# EasyEDA schematic N2onboardTelemetry.json
TITLE: Sheet_1; REV: 1.0; Date: 2022-01-05; Sheet: 1/1; Company: Your Company
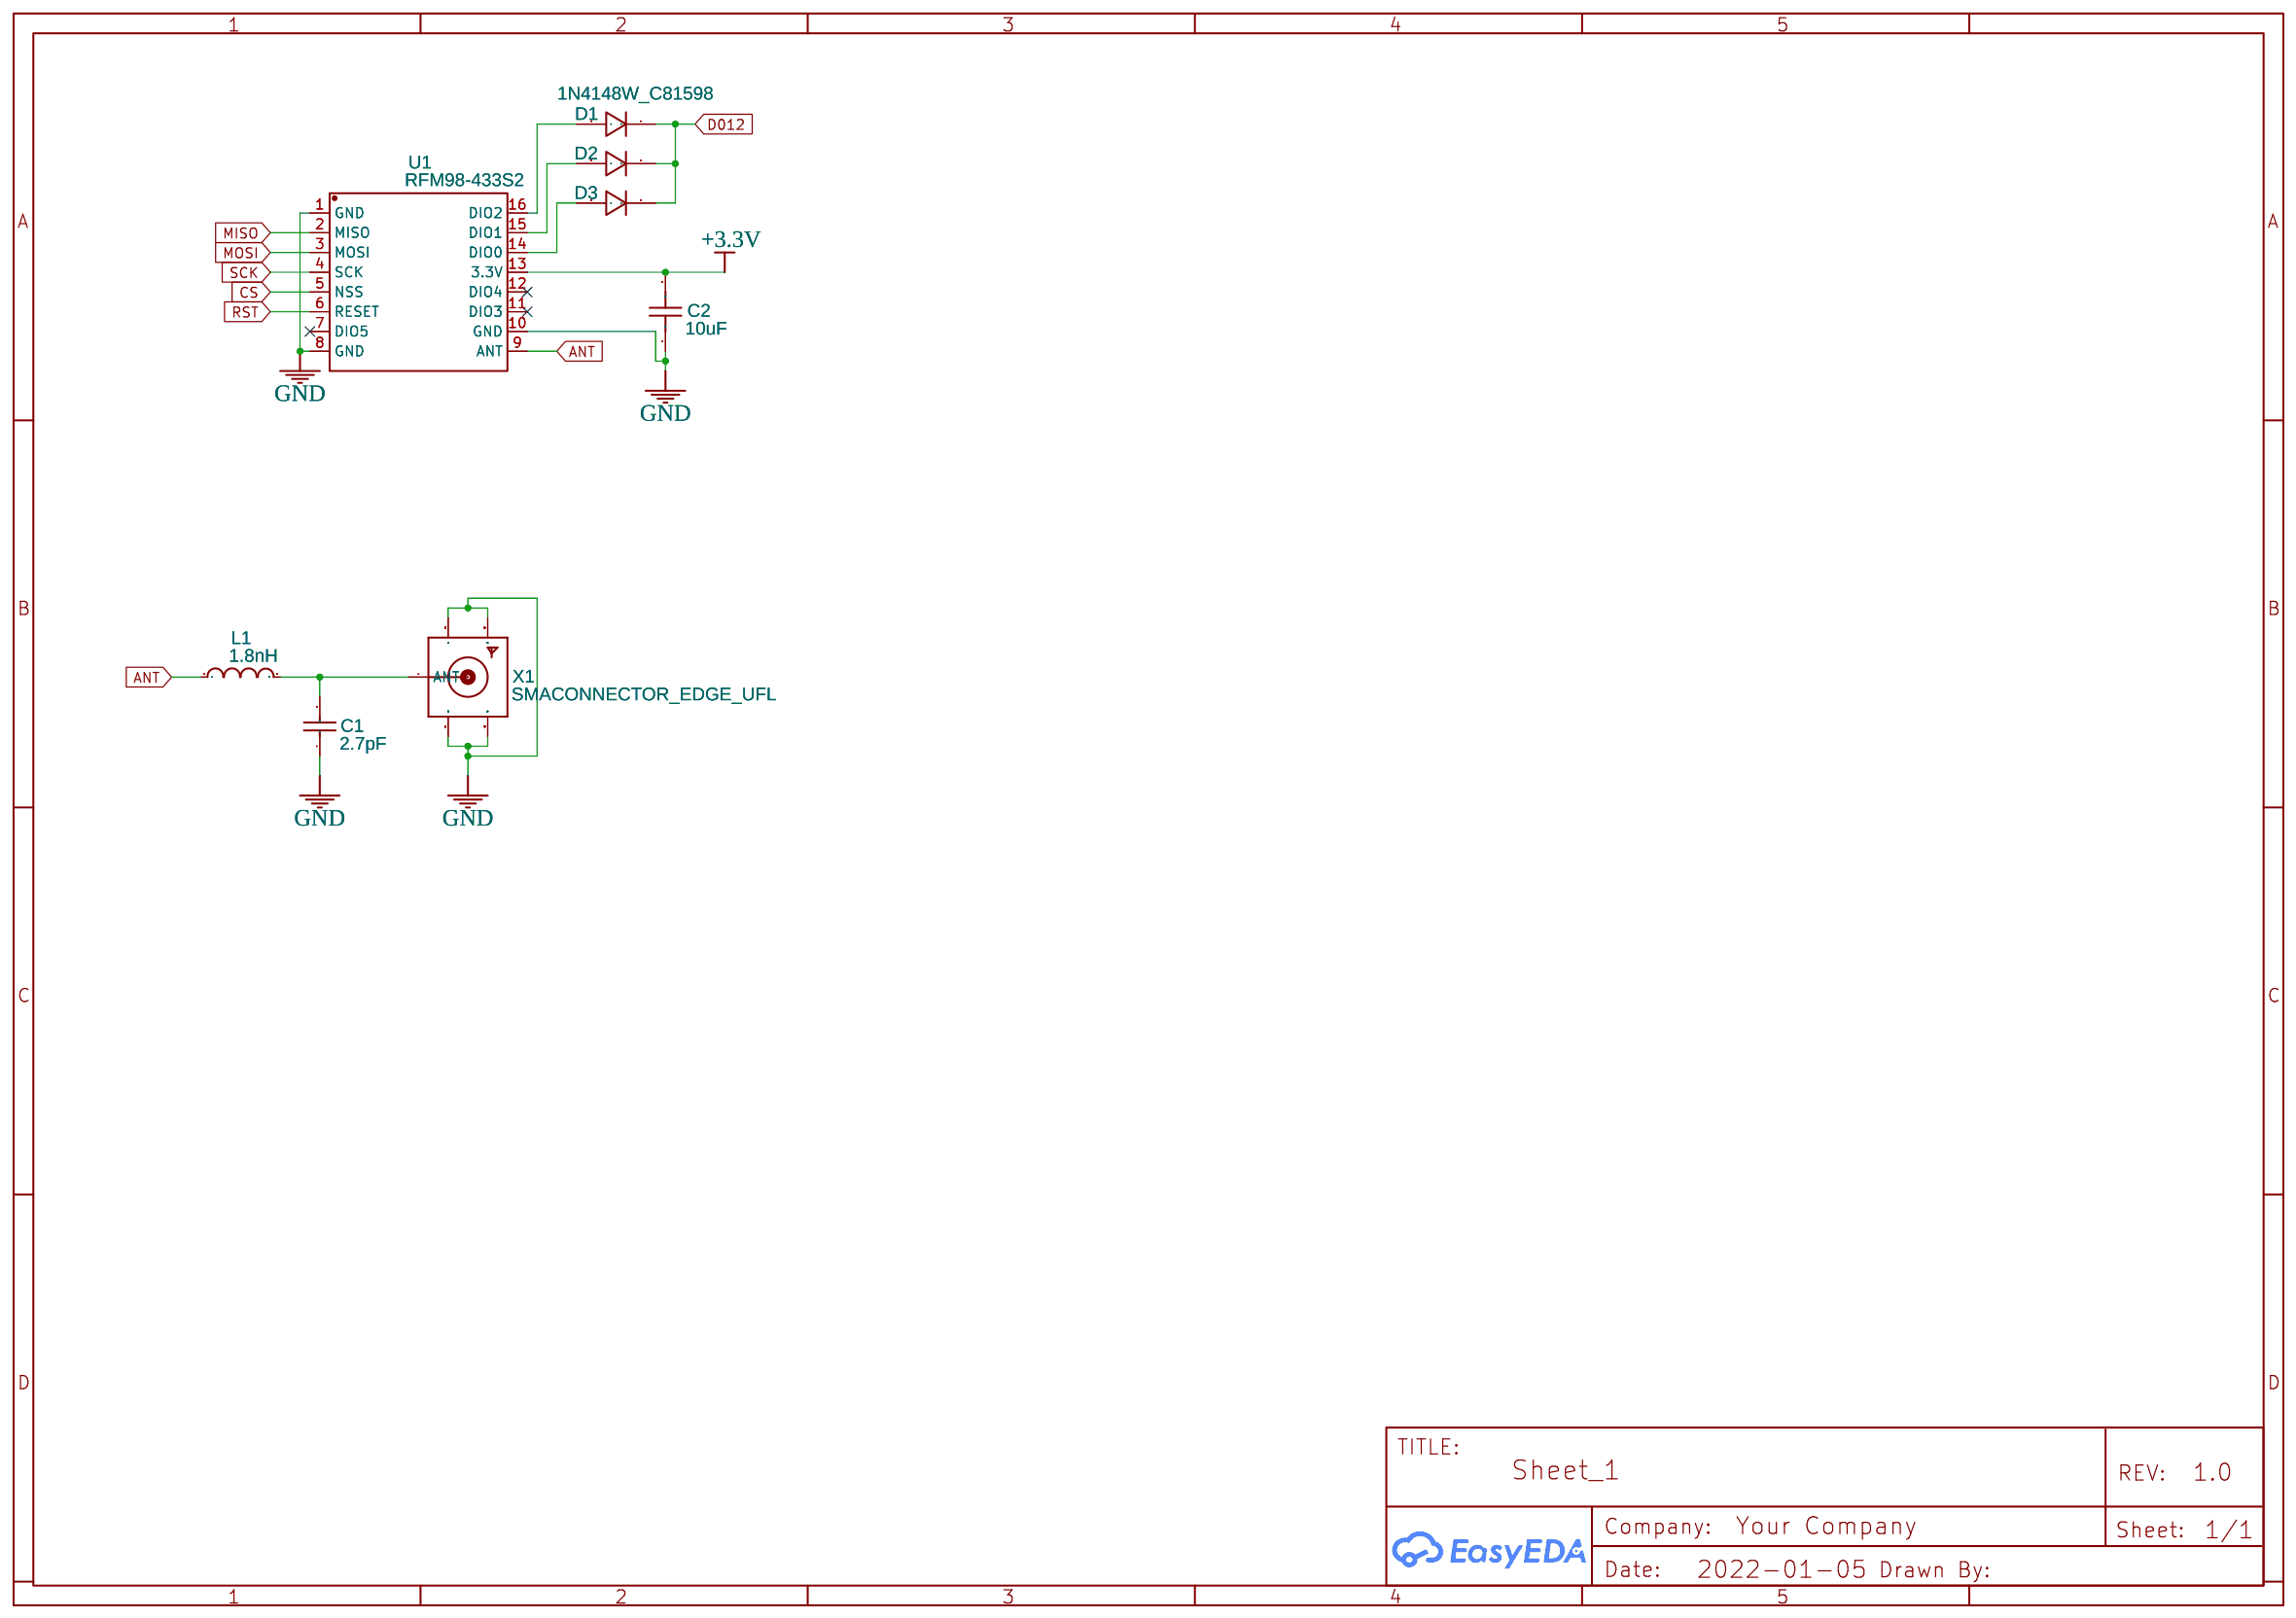
[diagram p0: schematic sheet]

## Parts
C1  2.7pF  [C0402]
C2  10uF  [C0603]
D1  1N4148W_C81598  [SOD-123F_L2.7-W1.6-LS3.8-RD]
D2  1N4148W_C81598  [SOD-123F_L2.7-W1.6-LS3.8-RD]
D3  1N4148W_C81598  [SOD-123F_L2.7-W1.6-LS3.8-RD]
L1  1.8nH  [L0402]
U1  RFM98-433S2  [WIRELM-SMD_RFM98-433S2]
X1  SMACONNECTOR_EDGE_UFL  [SMA_EDGELAUNCH_UFL]

## Library data of the parts
C1 = 0402CG2R7C500NT: Supplier: LCSC; Manufacturer: FH; Supplier Part: C1561; JLCPCB Part Class: Basic Part
C2 = CL10A106KP8NNNC: Supplier: LCSC; Manufacturer: SAMSUNG; Supplier Part: C19702; JLCPCB Part Class: Basic Part
D1-D3 = 1N4148W_C81598: Supplier: LCSC; Manufacturer: SEMTECH; Manufacturer Part: 1N4148W; Supplier Part: C81598; JLCPCB Part Class: Basic Part
L1 = HK10051N8S-T: Supplier: LCSC; Manufacturer: TAIYO YUDEN; Supplier Part: C89157
U1 = RFM98-433S2: Supplier: LCSC; Supplier Part: C171661; Manufacturer: HopeRF Micro-electronics; Contributor: LCSC; JLCPCB Part Class: Extended Part
X1 = SMACONNECTOR_EDGE_UFL: SMA Connector; Contributor: Adafruit

## Nets
+3.3V: C2.2 U1.13(3.3V)
GND: C1.1 C2.1 U1.1(GND) U1.8(GND) U1.10(GND) X1.GND@1(GND1) X1.GND@2(GND2) X1.GND@3(GND3) X1.GND@4(GND4)
ANT: L1.1 U1.9(ANT)
CS: U1.5(NSS)
D012: D1.1(K) D2.1(K) D3.1(K)
MISO: U1.2(MISO)
MOSI: U1.3(MOSI)
RST: U1.6(RESET)
SCK: U1.4(SCK)
Net-(C1-2): C1.2 L1.2 X1.P(ANT)
Net-(D1-2): D1.2(A) U1.16(DIO2)
Net-(D2-2): D2.2(A) U1.15(DIO1)
Net-(D3-2): D3.2(A) U1.14(DIO0)

Not connected (* = marked no-connect by the designer): U1 7(DIO5)* 11(DIO3)* 12(DIO4)*
